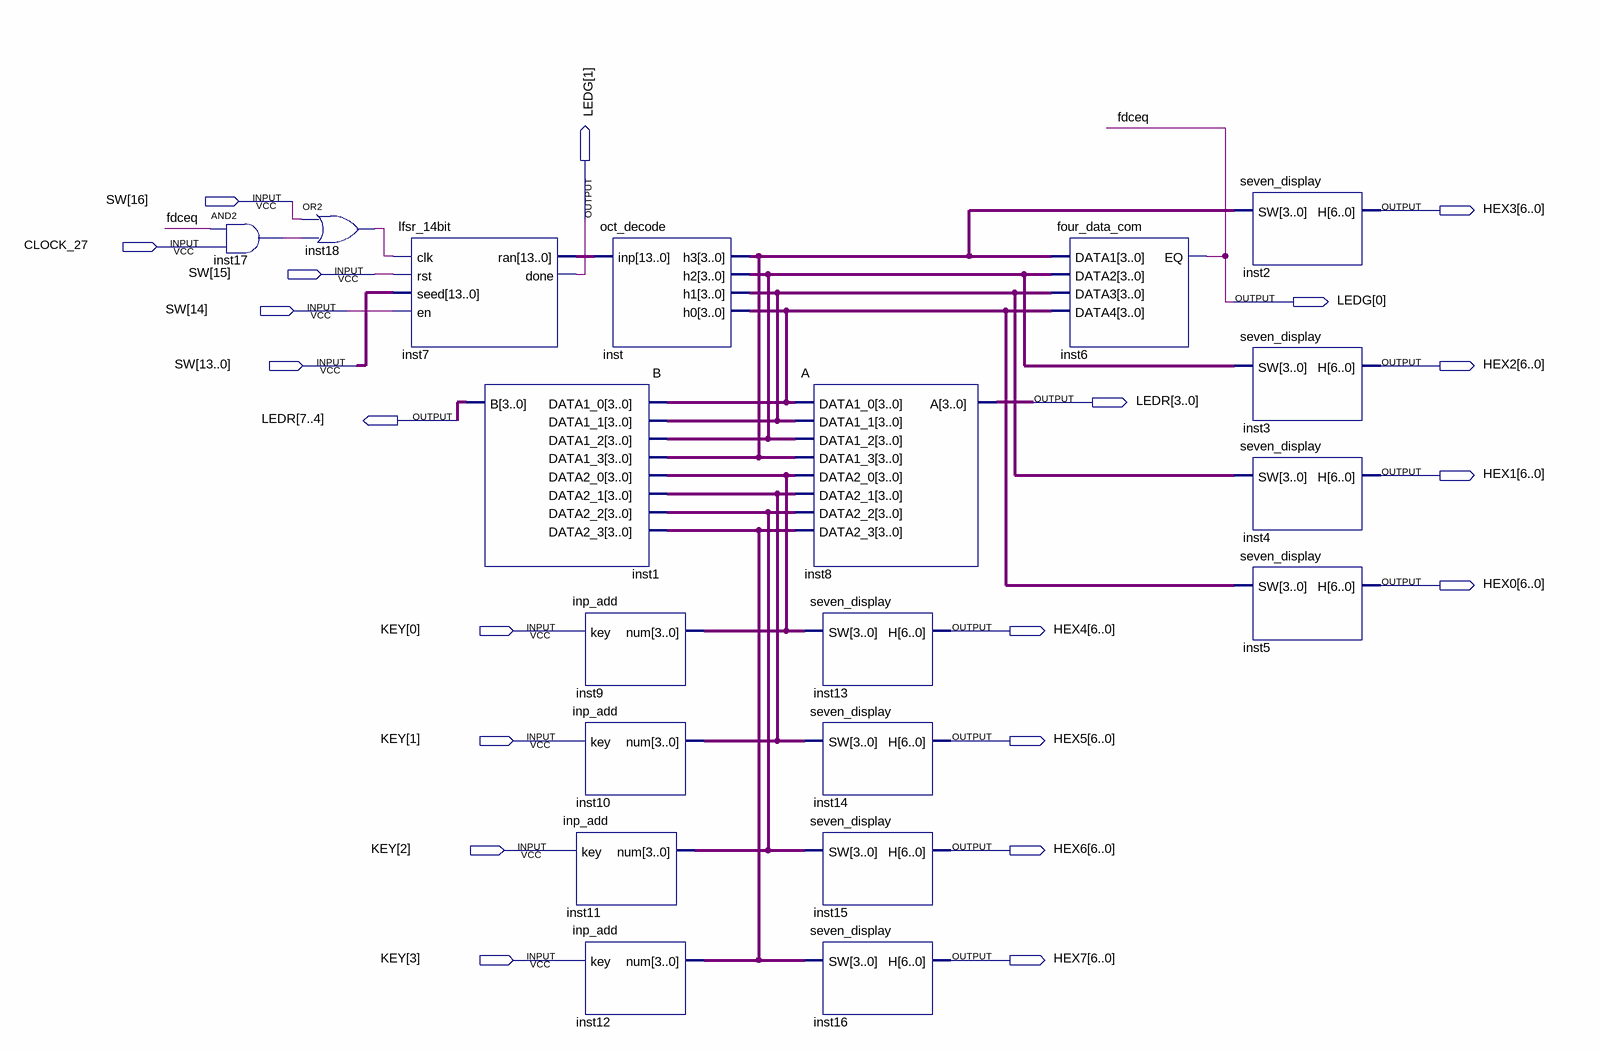
[diagram p0: schematic sheet]
// Quartus schematic test_block.bdf as structural Verilog: 19 symbols, 21 pins
module test_block (
  input  [16:0] SW,
  input  CLOCK_27,
  input  [3:0] KEY,
  output [6:0] HEX3,
  output [1:0] LEDG,
  output [6:0] HEX2,
  output [7:0] LEDR,
  output [6:0] HEX1,
  output [6:0] HEX0,
  output [6:0] HEX4,
  output [6:0] HEX5,
  output [6:0] HEX6,
  output [6:0] HEX7
);

  wire inst17_out, inst18_out;
  wire [3:0] inst9_num, inst10_num, inst11_num, inst12_num, inst_h0, inst_h1, inst_h2, inst_h3;
  wire [13:0] inst7_ran;

  and inst17 (inst17_out, LEDG[0], CLOCK_27);
  or inst18 (inst18_out, SW[16], inst17_out);
  lfsr_14bit inst7 (.clk(inst18_out), .rst(SW[15]), .seed(SW[13:0]), .en(SW[14]), .ran(inst7_ran), .done(LEDG[1]));
  B inst1 (
    .DATA1_0(inst_h0), .DATA1_1(inst_h1), .DATA1_2(inst_h2), .DATA1_3(inst_h3), .DATA2_0(inst9_num),
    .DATA2_1(inst10_num), .DATA2_2(inst11_num), .DATA2_3(inst12_num), .B(LEDR[7:4]));
  oct_decode inst (.inp(inst7_ran), .h3(inst_h3), .h2(inst_h2), .h1(inst_h1), .h0(inst_h0));
  inp_add inst9 (.key(KEY[0]), .num(inst9_num));
  inp_add inst10 (.key(KEY[1]), .num(inst10_num));
  inp_add inst11 (.key(KEY[2]), .num(inst11_num));
  inp_add inst12 (.key(KEY[3]), .num(inst12_num));
  A inst8 (
    .DATA1_0(inst_h0), .DATA1_1(inst_h1), .DATA1_2(inst_h2), .DATA1_3(inst_h3), .DATA2_0(inst9_num),
    .DATA2_1(inst10_num), .DATA2_2(inst11_num), .DATA2_3(inst12_num), .A(LEDR[3:0]));
  seven_display inst13 (.SW(inst9_num), .H(HEX4));
  seven_display inst14 (.SW(inst10_num), .H(HEX5));
  seven_display inst15 (.SW(inst11_num), .H(HEX6));
  seven_display inst16 (.SW(inst12_num), .H(HEX7));
  four_data_com inst6 (.DATA1(inst_h3), .DATA2(inst_h2), .DATA3(inst_h1), .DATA4(inst_h0), .EQ(LEDG[0]));
  seven_display inst2 (.SW(inst_h3), .H(HEX3));
  seven_display inst3 (.SW(inst_h2), .H(HEX2));
  seven_display inst4 (.SW(inst_h1), .H(HEX1));
  seven_display inst5 (.SW(inst_h0), .H(HEX0));

  // Other names for the same wires on the sheet: fdceq = LEDG[0]
endmodule
